# EAGLE design lm3915LEDv.1 (EAGLE 9.3.2)
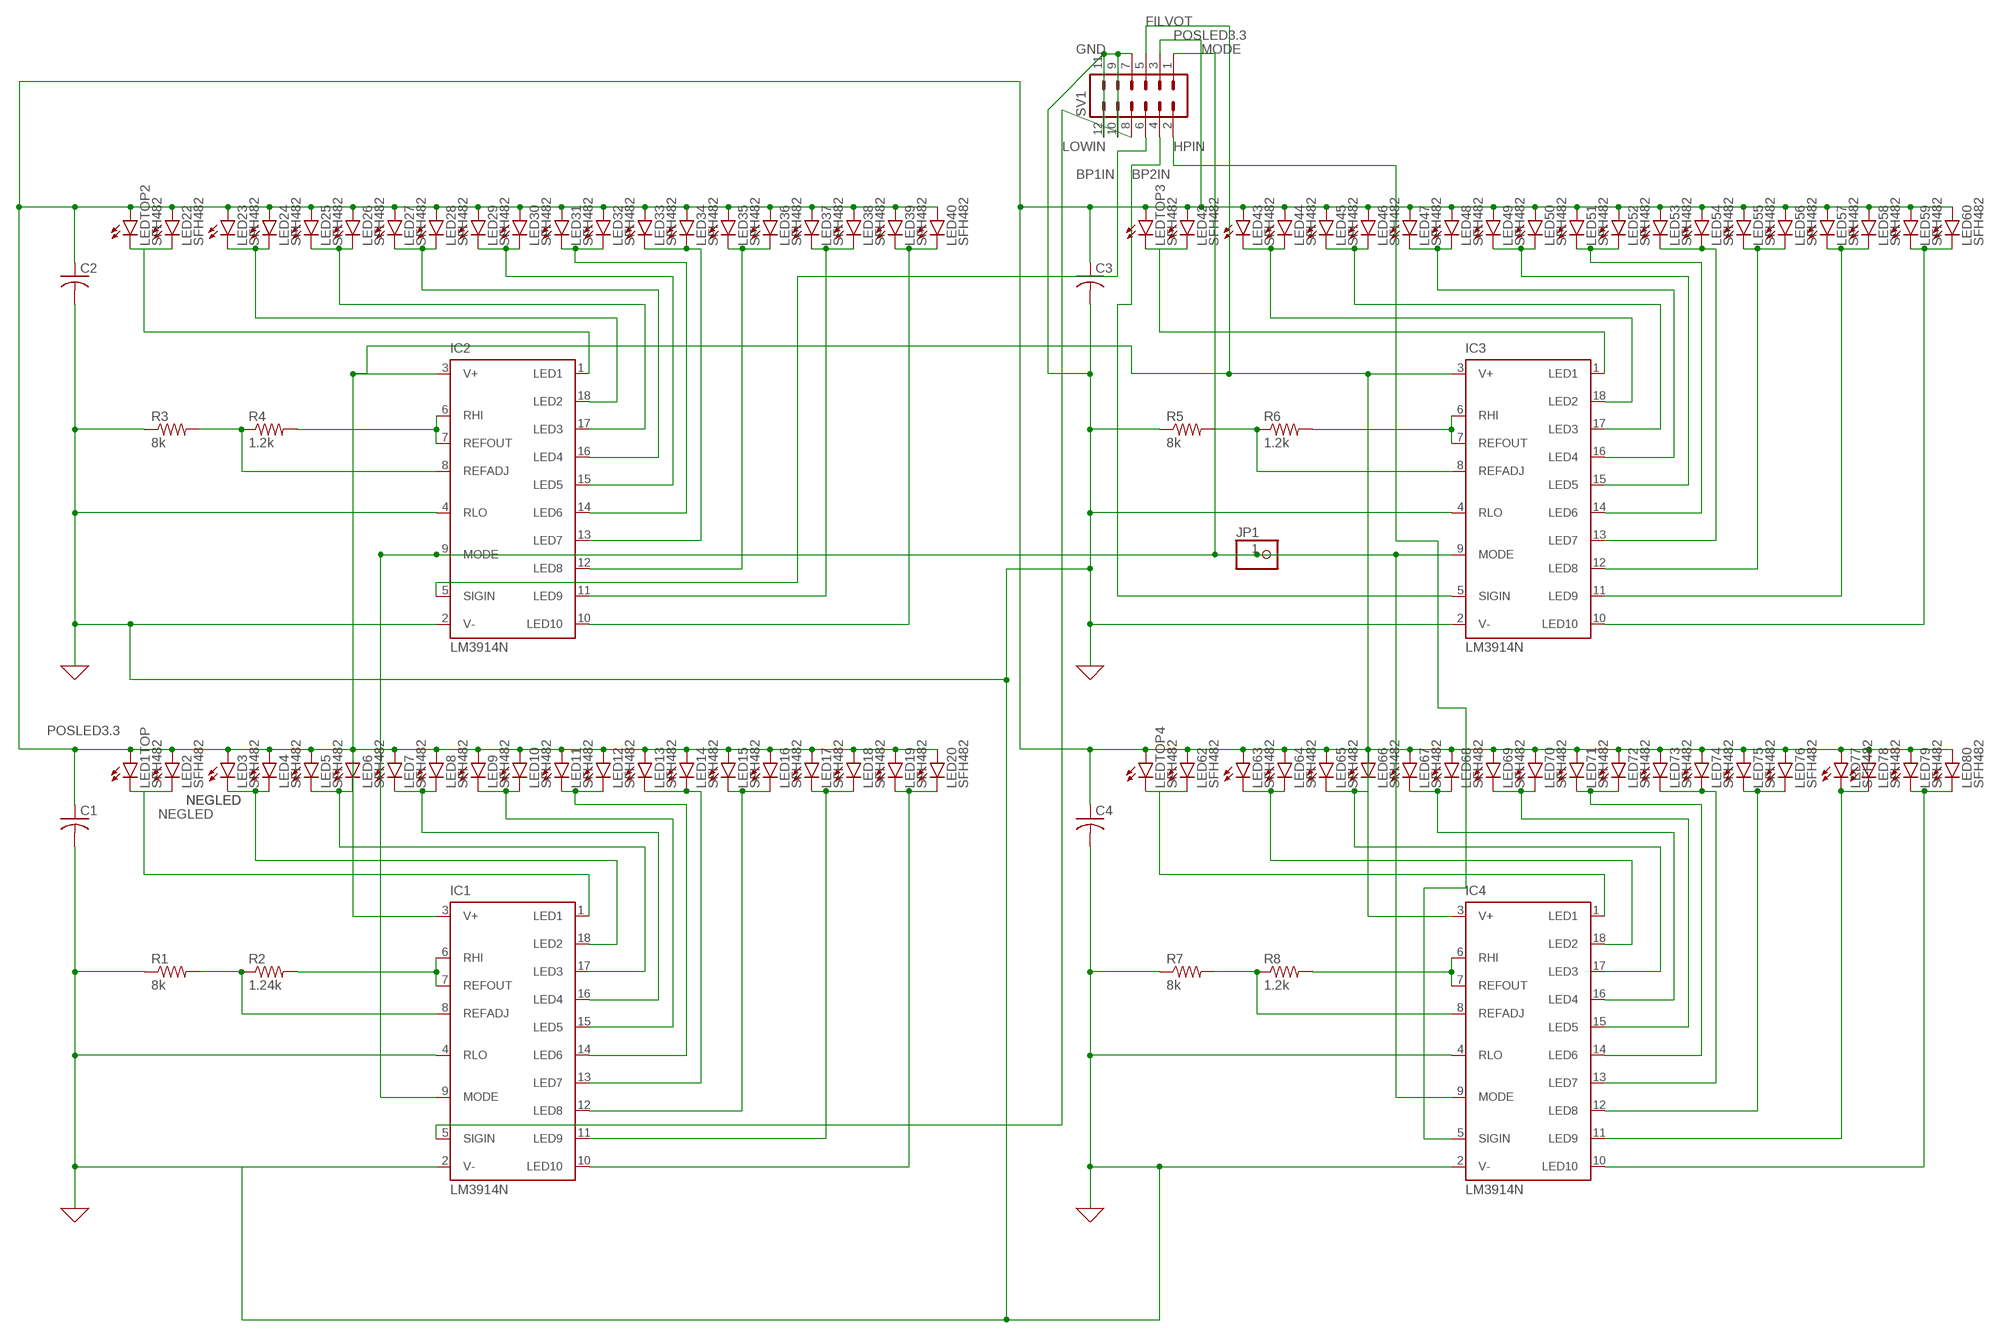
[diagram p0: schematic, sheet 1]

## Parts
C1  C-US025-030X050  [C025-030X050]
C2  C-US025-030X050  [C025-030X050]
C3  C-US025-030X050  [C025-030X050]
C4  C-US025-030X050  [C025-030X050]
IC1  LM3914N  [DIL18]
IC2  LM3914N  [DIL18]
IC3  LM3914N  [DIL18]
IC4  LM3914N  [DIL18]
JP1  PINHD-1X1  [1X01]
LED1TOP  SFH482  [SFH482]
LED2  SFH482  [SFH482]
LED3  SFH482  [SFH482]
LED4  SFH482  [SFH482]
LED5  SFH482  [SFH482]
LED6  SFH482  [SFH482]
LED7  SFH482  [SFH482]
LED8  SFH482  [SFH482]
LED9  SFH482  [SFH482]
LED10  SFH482  [SFH482]
LED11  SFH482  [SFH482]
LED12  SFH482  [SFH482]
LED13  SFH482  [SFH482]
LED14  SFH482  [SFH482]
LED15  SFH482  [SFH482]
LED16  SFH482  [SFH482]
LED17  SFH482  [SFH482]
LED18  SFH482  [SFH482]
LED19  SFH482  [SFH482]
LED20  SFH482  [SFH482]
LED22  SFH482  [SFH482]
LED23  SFH482  [SFH482]
LED24  SFH482  [SFH482]
LED25  SFH482  [SFH482]
LED26  SFH482  [SFH482]
LED27  SFH482  [SFH482]
LED28  SFH482  [SFH482]
LED29  SFH482  [SFH482]
LED30  SFH482  [SFH482]
LED31  SFH482  [SFH482]
LED32  SFH482  [SFH482]
LED33  SFH482  [SFH482]
LED34  SFH482  [SFH482]
LED35  SFH482  [SFH482]
LED36  SFH482  [SFH482]
LED37  SFH482  [SFH482]
LED38  SFH482  [SFH482]
LED39  SFH482  [SFH482]
LED40  SFH482  [SFH482]
LED42  SFH482  [SFH482]
LED43  SFH482  [SFH482]
LED44  SFH482  [SFH482]
LED45  SFH482  [SFH482]
LED46  SFH482  [SFH482]
LED47  SFH482  [SFH482]
LED48  SFH482  [SFH482]
LED49  SFH482  [SFH482]
LED50  SFH482  [SFH482]
LED51  SFH482  [SFH482]
LED52  SFH482  [SFH482]
LED53  SFH482  [SFH482]
LED54  SFH482  [SFH482]
LED55  SFH482  [SFH482]
LED56  SFH482  [SFH482]
LED57  SFH482  [SFH482]
LED58  SFH482  [SFH482]
LED59  SFH482  [SFH482]
LED60  SFH482  [SFH482]
LED62  SFH482  [SFH482]
LED63  SFH482  [SFH482]
LED64  SFH482  [SFH482]
LED65  SFH482  [SFH482]
LED66  SFH482  [SFH482]
LED67  SFH482  [SFH482]
LED68  SFH482  [SFH482]
LED69  SFH482  [SFH482]
LED70  SFH482  [SFH482]
LED71  SFH482  [SFH482]
LED72  SFH482  [SFH482]
LED73  SFH482  [SFH482]
LED74  SFH482  [SFH482]
LED75  SFH482  [SFH482]
LED76  SFH482  [SFH482]
LED77  SFH482  [SFH482]
LED78  SFH482  [SFH482]
LED79  SFH482  [SFH482]
LED80  SFH482  [SFH482]
LEDTOP2  SFH482  [SFH482]
LEDTOP3  SFH482  [SFH482]
LEDTOP4  SFH482  [SFH482]
R1  8k  R-US_0207/10  [0207/10]
R2  1.24k  R-US_0207/10  [0207/10]
R3  8k  R-US_0207/10  [0207/10]
R4  1.2k  R-US_0207/10  [0207/10]
R5  8k  R-US_0207/10  [0207/10]
R6  1.2k  R-US_0207/10  [0207/10]
R7  8k  R-US_0207/10  [0207/10]
R8  1.2k  R-US_0207/10  [0207/10]
SV1  MA06-2  [MA06-2]

## Nets
BP1IN: IC2.5(SIGIN) SV1.6
BP2IN: IC3.5(SIGIN) SV1.4
FILVOT: IC1.3(V+) IC2.3(V+) IC3.3(V+) IC4.3(V+) SV1.5
GND: C1.2 C2.2 C3.2 C4.2 IC1.2(V-) IC1.4(RLO) IC2.2(V-) IC2.4(RLO) IC3.2(V-) IC3.4(RLO) IC4.2(V-) IC4.4(RLO) R1.1 R3.1 R5.1 R7.1 SV1.7 SV1.9 SV1.10 SV1.11 SV1.12
HPIN: IC4.5(SIGIN) SV1.2
LOWIN: IC1.5(SIGIN) SV1.8
MODE: IC1.9(MODE) IC2.9(MODE) IC3.9(MODE) IC4.9(MODE) JP1.1 SV1.1
N$3: IC1.18(LED2) LED3.K(C) LED4.K(C)
N$4: IC1.17(LED3) LED5.K(C) LED6.K(C)
N$5: IC1.16(LED4) LED7.K(C) LED8.K(C)
N$6: IC1.15(LED5) LED9.K(C) LED10.K(C)
N$7: IC1.14(LED6) LED11.K(C) LED12.K(C)
N$8: IC1.13(LED7) LED13.K(C) LED14.K(C)
N$9: IC1.12(LED8) LED15.K(C) LED16.K(C)
N$10: IC1.11(LED9) LED17.K(C) LED18.K(C)
N$11: IC1.10(LED10) LED19.K(C) LED20.K(C)
N$12: IC4.1(LED1) LED62.K(C) LEDTOP4.K(C)
N$13: IC2.1(LED1) LED22.K(C) LEDTOP2.K(C)
N$14: IC2.18(LED2) LED23.K(C) LED24.K(C)
N$15: IC2.17(LED3) LED25.K(C) LED26.K(C)
N$16: IC2.16(LED4) LED27.K(C) LED28.K(C)
N$18: IC2.15(LED5) LED29.K(C) LED30.K(C)
N$21: IC1.6(RHI) IC1.7(REFOUT) R2.2
N$22: IC1.8(REFADJ) R1.2 R2.1
N$23: IC2.14(LED6) LED31.K(C) LED32.K(C)
N$24: IC2.13(LED7) LED33.K(C) LED34.K(C)
N$25: IC2.12(LED8) LED35.K(C) LED36.K(C)
N$26: IC2.11(LED9) LED37.K(C) LED38.K(C)
N$27: IC2.10(LED10) LED39.K(C) LED40.K(C)
N$31: IC2.6(RHI) IC2.7(REFOUT) R4.2
N$32: IC2.8(REFADJ) R3.2 R4.1
N$33: IC3.1(LED1) LED42.K(C) LEDTOP3.K(C)
N$34: IC3.18(LED2) LED43.K(C) LED44.K(C)
N$35: IC3.17(LED3) LED45.K(C) LED46.K(C)
N$36: IC3.16(LED4) LED47.K(C) LED48.K(C)
N$37: IC3.15(LED5) LED49.K(C) LED50.K(C)
N$38: IC3.14(LED6) LED51.K(C) LED52.K(C)
N$39: IC3.13(LED7) LED53.K(C) LED54.K(C)
N$40: IC3.12(LED8) LED55.K(C) LED56.K(C)
N$41: IC3.11(LED9) LED57.K(C) LED58.K(C)
N$42: IC3.10(LED10) LED59.K(C) LED60.K(C)
N$46: IC3.6(RHI) IC3.7(REFOUT) R6.2
N$47: IC3.8(REFADJ) R5.2 R6.1
N$48: IC4.18(LED2) LED63.K(C) LED64.K(C)
N$49: IC4.17(LED3) LED65.K(C) LED66.K(C)
N$50: IC4.16(LED4) LED67.K(C) LED68.K(C)
N$51: IC4.15(LED5) LED69.K(C) LED70.K(C)
N$52: IC4.14(LED6) LED71.K(C) LED72.K(C)
N$53: IC4.13(LED7) LED73.K(C) LED74.K(C)
N$54: IC4.12(LED8) LED75.K(C) LED76.K(C)
N$55: IC4.11(LED9) LED77.K(C) LED78.K(C)
N$56: IC4.10(LED10) LED79.K(C) LED80.K(C)
N$60: IC4.6(RHI) IC4.7(REFOUT) R8.2
N$61: IC4.8(REFADJ) R7.2 R8.1
NEGLED: IC1.1(LED1) LED1TOP.K(C) LED2.K(C)
POSLED3.3: C1.1 C2.1 C3.1 C4.1 LED1TOP.A LED2.A LED3.A LED4.A LED5.A LED6.A LED7.A LED8.A LED9.A LED10.A LED11.A LED12.A LED13.A LED14.A LED15.A LED16.A LED17.A LED18.A LED19.A LED20.A LED22.A LED23.A LED24.A LED25.A LED26.A LED27.A LED28.A LED29.A LED30.A LED31.A LED32.A LED33.A LED34.A LED35.A LED36.A LED37.A LED38.A LED39.A LED40.A LED42.A LED43.A LED44.A LED45.A LED46.A LED47.A LED48.A LED49.A LED50.A LED51.A LED52.A LED53.A LED54.A LED55.A LED56.A LED57.A LED58.A LED59.A LED60.A LED62.A LED63.A LED64.A LED65.A LED66.A LED67.A LED68.A LED69.A LED70.A LED71.A LED72.A LED73.A LED74.A LED75.A LED76.A LED77.A LED78.A LED79.A LED80.A LEDTOP2.A LEDTOP3.A LEDTOP4.A SV1.3

## Library data of the parts
C1-C4 = rcl:C-US: CAPACITOR, American symbol; SPICEPREFIX: C
IC1-IC4 = national-semiconductor:LM391: Dot/Bar Display Driver Source: Data sheet LM3915 <http://www.national.com/ds/LM/LM3915.pdf> Data sheet LM3914 <http://www.national.com/ds/LM/LM3914.pdf>
JP1 = pinhead:PINHD-1X1: PIN HEADER
LED1TOP LED2-LED20 LED22-LED40 LED42-LED60 LED62-LED80 LEDTOP2-LEDTOP4 = led:SFH482: IR LED infrared emitting diode, Infineon
R1-R8 = rcl:R-US_: RESISTOR, American symbol; SPICEPREFIX: R
SV1 = con-lstb:MA06-2: PIN HEADER; OC_FARNELL: unknown; OC_NEWARK: unknown

## Net classes
0 default: clearance 0.205 mm

## Board
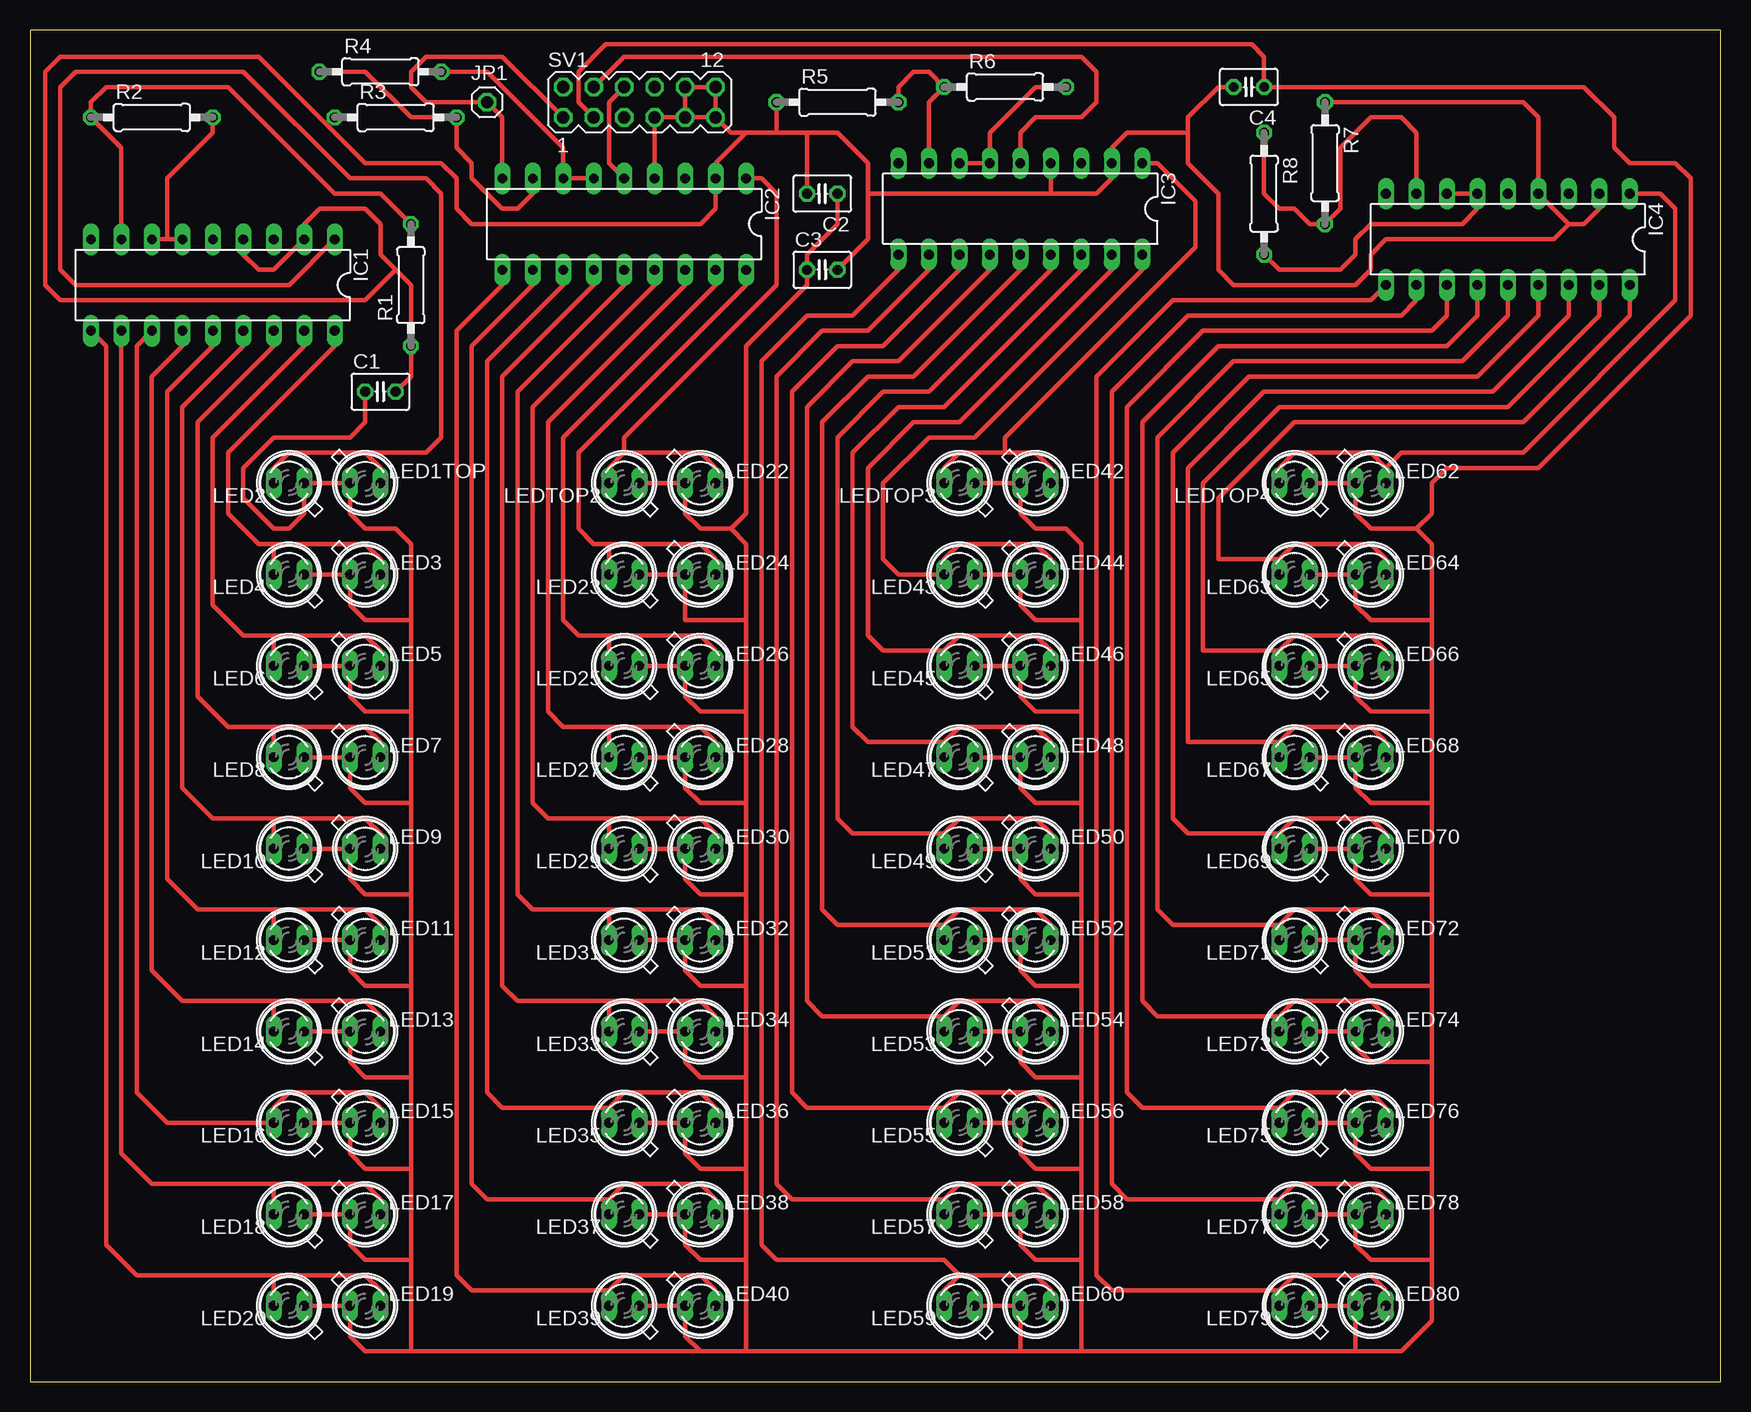
[diagram p1: board, top side]
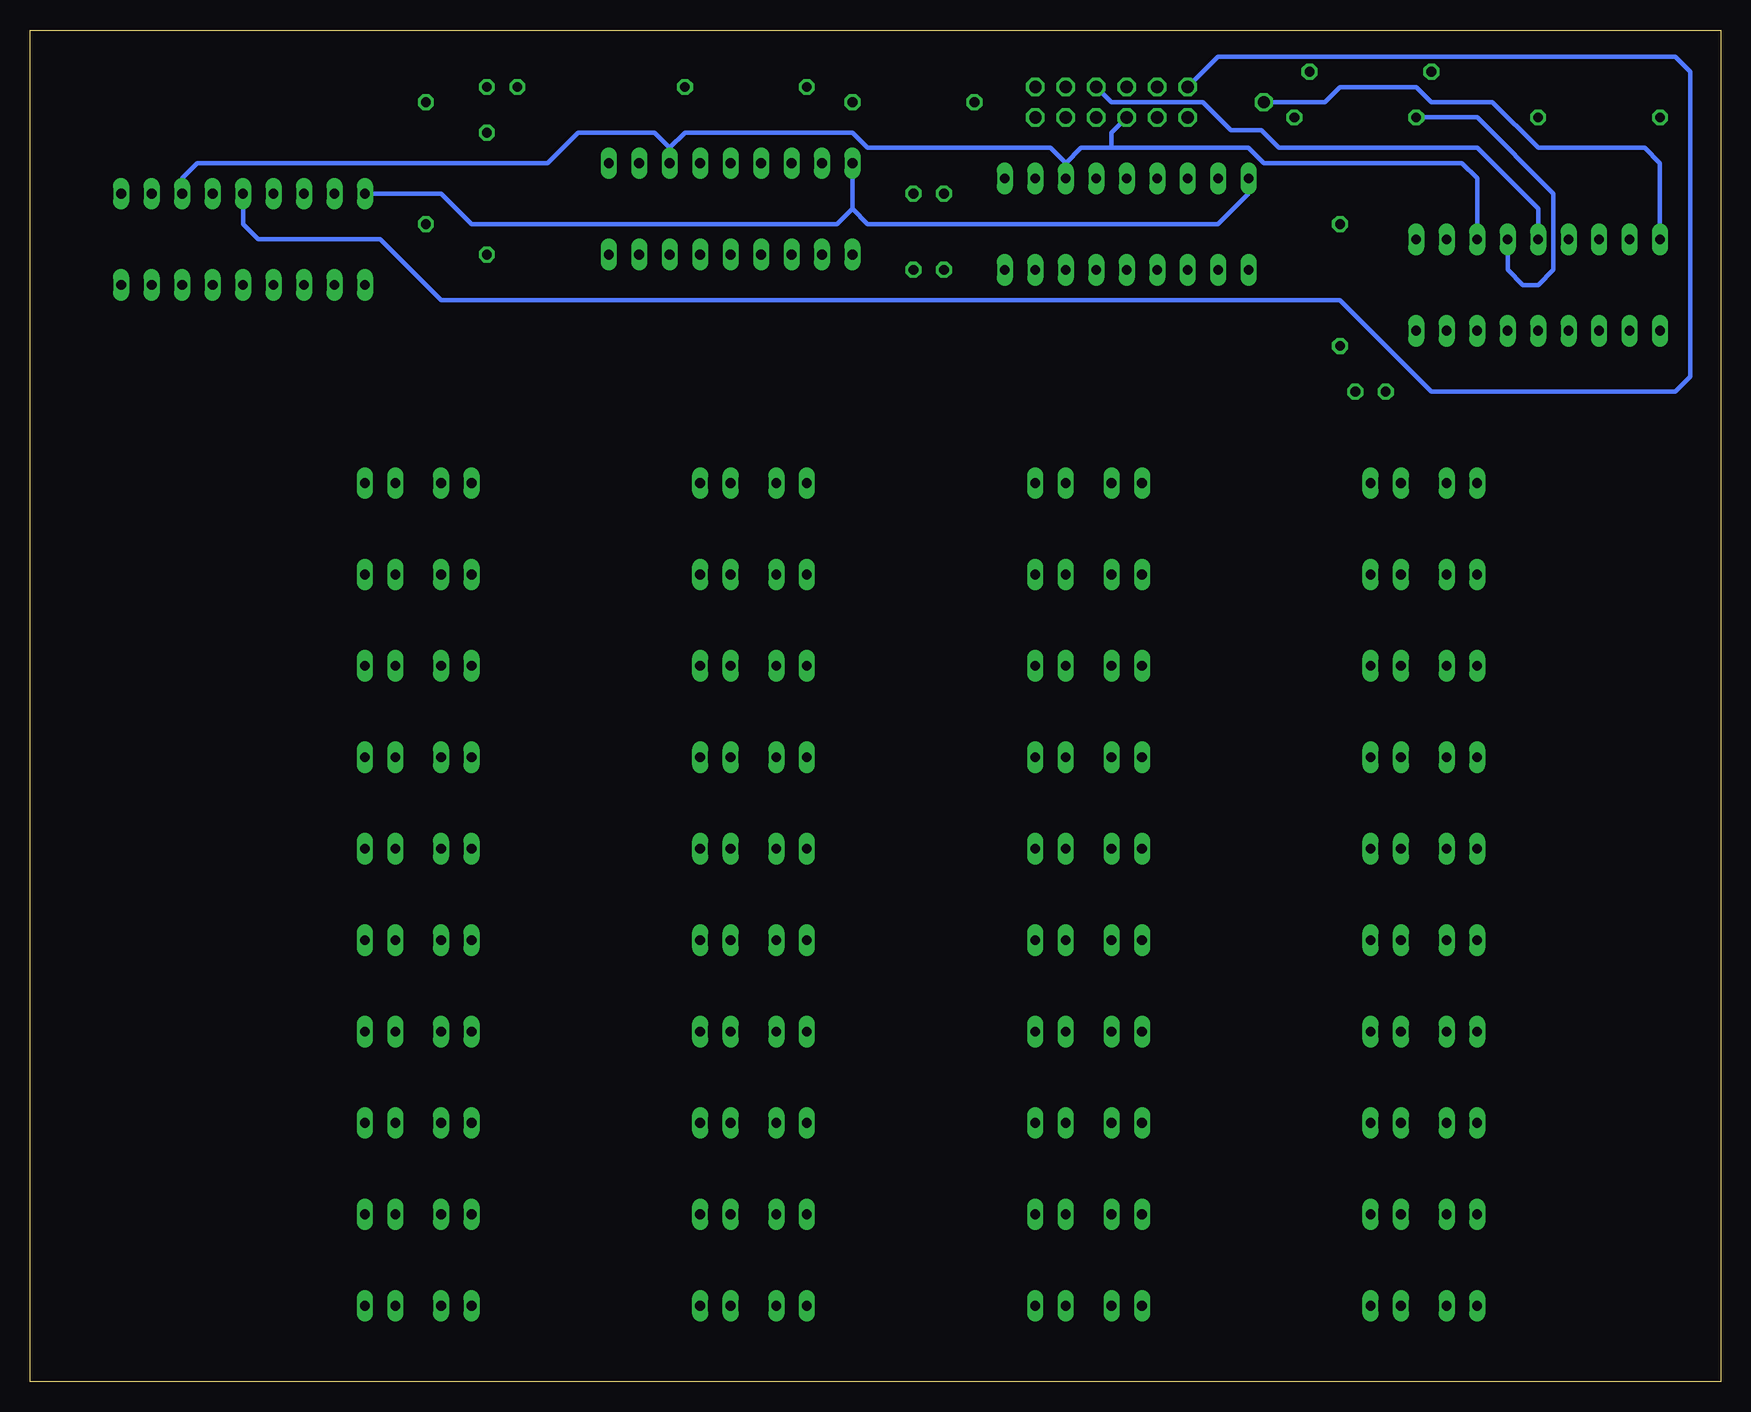
[diagram p2: board, bottom side, seen from below]

Size 140.95 x 112.7 mm. Coordinates in mm from the lower left corner, seen from the top.
Outline: 0,0 140.95,0 140.95,112.7 0,112.7 0,0
Copper layers (1*16): Top 0.035mm / dielectric 1.5mm / Bottom 0.035mm
Design rules "default": minimum track width 6mil, minimum drill 0.35mm, track to track 6mil, track to pad 6mil, pad to pad 6mil, via to via 6mil, smd to smd 6mil, copper to edge 40mil, drill to drill 6mil, minimum pad ring 10mil, minimum via ring 8mil, stop-mask expansion 4mil, vias tented up to drill 0mil, thermal gap 10mil

### Footprints (pad centres in the part's own frame; a part is rotated, then mirrored left to right if it is on the bottom)
C025-030X050 = drill 0.813 octagon: 1 -1.27,0; 2 1.27,0
DIL18 = drill 0.813 long: 1 -10.16,-3.81; 2 -7.62,-3.81; 3 -5.08,-3.81; 4 -2.54,-3.81; 5 0,-3.81; 6 2.54,-3.81; 7 5.08,-3.81; 8 7.62,-3.81; 9 10.16,-3.81; 10 10.16,3.81; 11 7.62,3.81; 12 5.08,3.81; 13 2.54,3.81; 14 0,3.81; 15 -2.54,3.81; 16 -5.08,3.81; 17 -7.62,3.81; 18 -10.16,3.81
1X01 = drill 1.016 octagon: 1 0,0
SFH482 = drill 0.813 long: A -1.27,0; K 1.27,0
0207/10 = drill 0.813 octagon: 1 -5.08,0; 2 5.08,0
MA06-2 = drill 1.016 octagon: 1 -6.35,-1.27; 2 -6.35,1.27; 3 -3.81,-1.27; 4 -3.81,1.27; 5 -1.27,-1.27; 6 -1.27,1.27; 7 1.27,-1.27; 8 1.27,1.27; 9 3.81,-1.27; 10 3.81,1.27; 11 6.35,-1.27; 12 6.35,1.27

### Placement (x,y rotation side)
C1  29.21,82.55 0 top
C2  66.04,99.06 180 top
C3  66.04,92.71 0 top
C4  101.6,107.95 180 top
IC1  15.24,91.44 180 top
IC2  49.53,96.52 180 top
IC3  82.55,97.79 180 top
IC4  123.19,95.25 180 top
JP1  38.1,106.68 0 top
LED1TOP  27.94,74.93 0 top
LED2  21.59,74.93 180 top
LED3  27.94,67.31 0 top
LED4  21.59,67.31 180 top
LED5  27.94,59.69 0 top
LED6  21.59,59.69 180 top
LED7  27.94,52.07 0 top
LED8  21.59,52.07 180 top
LED9  27.94,44.45 0 top
LED10  21.59,44.45 180 top
LED11  27.94,36.83 0 top
LED12  21.59,36.83 180 top
LED13  27.94,29.21 0 top
LED14  21.59,29.21 180 top
LED15  27.94,21.59 0 top
LED16  21.59,21.59 180 top
LED17  27.94,13.97 0 top
LED18  21.59,13.97 180 top
LED19  27.94,6.35 0 top
LED20  21.59,6.35 180 top
LED22  55.88,74.93 0 top
LED23  49.53,67.31 180 top
LED24  55.88,67.31 0 top
LED25  49.53,59.69 180 top
LED26  55.88,59.69 0 top
LED27  49.53,52.07 180 top
LED28  55.88,52.07 0 top
LED29  49.53,44.45 180 top
LED30  55.88,44.45 0 top
LED31  49.53,36.83 180 top
LED32  55.88,36.83 0 top
LED33  49.53,29.21 180 top
LED34  55.88,29.21 0 top
LED35  49.53,21.59 180 top
LED36  55.88,21.59 0 top
LED37  49.53,13.97 180 top
LED38  55.88,13.97 0 top
LED39  49.53,6.35 180 top
LED40  55.88,6.35 0 top
LED42  83.82,74.93 0 top
LED43  77.47,67.31 180 top
LED44  83.82,67.31 0 top
LED45  77.47,59.69 180 top
LED46  83.82,59.69 0 top
LED47  77.47,52.07 180 top
LED48  83.82,52.07 0 top
LED49  77.47,44.45 180 top
LED50  83.82,44.45 0 top
LED51  77.47,36.83 180 top
LED52  83.82,36.83 0 top
LED53  77.47,29.21 180 top
LED54  83.82,29.21 0 top
LED55  77.47,21.59 180 top
LED56  83.82,21.59 0 top
LED57  77.47,13.97 180 top
LED58  83.82,13.97 0 top
LED59  77.47,6.35 180 top
LED60  83.82,6.35 0 top
LED62  111.76,74.93 0 top
LED63  105.41,67.31 180 top
LED64  111.76,67.31 0 top
LED65  105.41,59.69 180 top
LED66  111.76,59.69 0 top
LED67  105.41,52.07 180 top
LED68  111.76,52.07 0 top
LED69  105.41,44.45 180 top
LED70  111.76,44.45 0 top
LED71  105.41,36.83 180 top
LED72  111.76,36.83 0 top
LED73  105.41,29.21 180 top
LED74  111.76,29.21 0 top
LED75  105.41,21.59 180 top
LED76  111.76,21.59 0 top
LED77  105.41,13.97 180 top
LED78  111.76,13.97 0 top
LED79  105.41,6.35 180 top
LED80  111.76,6.35 0 top
LEDTOP2  49.53,74.93 180 top
LEDTOP3  77.47,74.93 180 top
LEDTOP4  105.41,74.93 180 top
R1  31.75,91.44 90 top
R2  10.16,105.41 0 top
R3  30.48,105.41 0 top
R4  29.21,109.22 0 top
R5  67.31,106.68 0 top
R6  81.28,107.95 0 top
R7  107.95,101.6 270 top
R8  102.87,99.06 270 top
SV1  50.8,106.68 0 top

### Tracks (layer width: path | path; a pad name or v marks a point on that pad's centre or on a via)
BP1IN
  Top 0.381: SV1.6 48.26,106.68 48.26,101.6 IC2.5
BP2IN
  Top 0.381: SV1.4 49.53,110.49 87.63,110.49 88.9,109.22 88.9,106.68 87.63,105.41 83.82,105.41 82.55,104.14 IC3.5
FILVOT
  Bottom 0.381: IC4.3 128.27,100.33 127,101.6 97.79,101.6 95.25,104.14 88.9,104.14 87.63,102.87 | IC3.3 87.63,102.87 | 50.8,102.87 39.37,102.87 38.1,101.6 21.59,101.6 20.32,100.33 IC1.3 | 50.8,102.87 53.34,102.87 54.61,101.6 | 54.61,101.6 55.88,102.87 71.12,102.87 72.39,104.14 86.36,104.14 87.63,102.87 | SV1.5 50.8,104.14 50.8,102.87 | IC2.3 54.61,101.6
GND
  Top 0.381: IC3.4 85.09,99.06 | 85.09,99.06 69.85,99.06 | 59.69,104.14 57.15,101.6 IC2.2 57.15,97.79 55.88,96.52 36.83,96.52 35.56,97.79 35.56,100.33 34.29,101.6 27.94,101.6 19.05,110.49 2.54,110.49 1.27,109.22 1.27,91.44 2.54,90.17 27.94,90.17 30.48,92.71 | 59.69,104.14 62.23,104.14 | 62.23,104.14 64.77,104.14 | 64.77,104.14 C2.2 | 69.85,99.06 69.85,95.25 C3.2 | 69.85,99.06 69.85,101.6 67.31,104.14 64.77,104.14 | 85.09,99.06 88.9,99.06 90.17,100.33 IC3.2 90.17,102.87 91.44,104.14 96.52,104.14 | 62.23,104.14 R5.1 | 128.27,96.52 IC4.4 125.73,105.41 124.46,106.68 R7.1 | 128.27,96.52 129.54,96.52 130.81,97.79 IC4.2 | 96.52,104.14 96.52,105.41 99.06,107.95 C4.2 | 96.52,104.14 96.52,101.6 99.06,99.06 99.06,92.71 100.33,91.44 110.49,91.44 111.76,92.71 111.76,93.98 113.03,95.25 127,95.25 128.27,96.52 | IC1.4 17.78,93.98 19.05,92.71 20.32,92.71 IC1.2 22.86,96.52 24.13,97.79 27.94,97.79 29.21,96.52 29.21,93.98 30.48,92.71 | C1.2 31.75,83.82 R1.1 31.75,91.44 30.48,92.71 | SV1.9 SV1.7 IC2.4 | SV1.9 SV1.10 SV1.12 SV1.11 | SV1.11 SV1.9 | SV1.11 58.42,104.14 59.69,104.14
  Bottom 0.381: R3.1 20.32,105.41 13.97,99.06 13.97,92.71 15.24,91.44 16.51,91.44 17.78,92.71 IC1.4
HPIN
  Bottom 0.381: SV1.2 41.91,110.49 3.81,110.49 2.54,109.22 2.54,83.82 3.81,82.55 24.13,82.55 31.75,90.17 106.68,90.17 111.76,95.25 121.92,95.25 123.19,96.52 IC4.5
LOWIN
  Bottom 0.381: IC1.5 15.24,97.79 20.32,102.87 36.83,102.87 38.31,104.35 40.85,104.35 43.18,106.68 50.8,106.68 SV1.8
MODE
  Top 0.381: SV1.1 39.37,110.49 33.02,110.49 31.75,109.22 31.75,107.95 33.02,106.68 JP1.1 39.37,105.41 IC2.9
  Bottom 0.381: 72.39,97.79 71.12,96.52 41.91,96.52 39.37,99.06 IC2.9 | 72.39,97.79 IC3.9 | 72.39,97.79 73.66,96.52 104.14,96.52 106.68,99.06 IC4.9 | IC1.9 5.08,101.6 6.35,102.87 15.24,102.87 19.05,106.68 24.13,106.68 25.4,107.95 31.75,107.95 33.02,106.68 JP1.1
N$3
  Top 0.381: 20.32,69.85 LED4.K | 20.32,69.85 19.05,69.85 16.51,72.39 16.51,77.47 25.4,86.36 IC1.18 | 20.32,69.85 27.94,69.85 29.21,68.58 LED3.K
N$4
  Top 0.381: LED5.K 29.21,60.96 27.94,62.23 20.32,62.23 | 20.32,62.23 LED6.K | 20.32,62.23 17.78,62.23 15.24,64.77 15.24,78.74 22.86,86.36 IC1.17
N$5
  Top 0.381: LED7.K 29.21,53.34 27.94,54.61 20.32,54.61 | 20.32,54.61 LED8.K | 20.32,54.61 16.51,54.61 13.97,57.15 13.97,80.01 20.32,86.36 IC1.16
N$6
  Top 0.381: LED9.K 29.21,45.72 27.94,46.99 20.32,46.99 | 20.32,46.99 LED10.K | IC1.15 17.78,86.36 12.7,81.28 12.7,49.53 15.24,46.99 20.32,46.99
N$7
  Top 0.381: LED11.K 29.21,38.1 27.94,39.37 20.32,39.37 | 20.32,39.37 LED12.K | 20.32,39.37 13.97,39.37 11.43,41.91 11.43,82.55 15.24,86.36 IC1.14
N$8
  Top 0.381: LED13.K 29.21,30.48 27.94,31.75 20.32,31.75 | 20.32,31.75 LED14.K | IC1.13 12.7,86.36 10.16,83.82 10.16,34.29 12.7,31.75 20.32,31.75
N$9
  Top 0.381: LED15.K 29.21,22.86 27.94,24.13 21.59,24.13 20.32,22.86 LED16.K 11.43,21.59 8.89,24.13 8.89,86.36 IC1.12
N$10
  Top 0.381: LED17.K 29.21,15.24 27.94,16.51 20.32,16.51 | 20.32,16.51 LED18.K | 20.32,16.51 10.16,16.51 7.62,19.05 IC1.11
N$11
  Top 0.381: LED19.K 29.21,7.62 27.94,8.89 20.32,8.89 | 20.32,8.89 LED20.K | 20.32,8.89 8.89,8.89 6.35,11.43 6.35,86.36 IC1.10
N$12
  Top 0.381: LEDTOP4.K 104.14,76.2 105.41,77.47 111.76,77.47 113.03,76.2 | 113.03,76.2 LED62.K | 113.03,76.2 114.3,77.47 124.46,77.47 137.16,90.17 137.16,97.79 135.89,99.06 IC4.1
N$13
  Top 0.381: LEDTOP2.K 48.26,76.2 49.53,77.47 | 49.53,77.47 55.88,77.47 57.15,76.2 LED22.K | 49.53,77.47 49.53,78.74 62.23,91.44 62.23,99.06 60.96,100.33 IC2.1
N$14
  Top 0.381: LED23.K 48.26,69.85 | LED24.K 57.15,68.58 55.88,69.85 48.26,69.85 | 48.26,69.85 46.99,69.85 45.72,71.12 45.72,77.47 59.69,91.44 IC2.18
N$15
  Top 0.381: LED26.K 57.15,60.96 55.88,62.23 48.26,62.23 | 48.26,62.23 LED25.K | 48.26,62.23 45.72,62.23 44.45,63.5 44.45,78.74 57.15,91.44 IC2.17
N$16
  Top 0.381: 48.26,54.61 LED27.K | LED28.K 57.15,53.34 55.88,54.61 48.26,54.61 | 48.26,54.61 44.45,54.61 43.18,55.88 43.18,80.01 54.61,91.44 IC2.16
N$18
  Top 0.381: LED30.K 57.15,45.72 55.88,46.99 48.26,46.99 | 48.26,46.99 LED29.K | 48.26,46.99 43.18,46.99 41.91,48.26 41.91,81.28 52.07,91.44 IC2.15
N$21
  Top 0.381: IC1.6 IC1.7 11.43,95.25 11.43,100.33 15.24,104.14 R2.2
N$22
  Top 0.381: R1.2 29.21,99.06 25.4,99.06 16.51,107.95 6.35,107.95 5.08,106.68 R2.1 7.62,102.87 IC1.8
N$23
  Top 0.381: 48.26,39.37 LED31.K | LED32.K 57.15,38.1 55.88,39.37 48.26,39.37 | 48.26,39.37 41.91,39.37 40.64,40.64 40.64,82.55 49.53,91.44 IC2.14
N$24
  Top 0.381: 48.26,31.75 LED33.K | 48.26,31.75 55.88,31.75 57.15,30.48 LED34.K | 48.26,31.75 40.64,31.75 39.37,33.02 39.37,83.82 46.99,91.44 IC2.13
N$25
  Top 0.381: 48.26,22.86 LED35.K | LED36.K 57.15,22.86 55.88,24.13 49.53,24.13 48.26,22.86 | 48.26,22.86 39.37,22.86 38.1,24.13 38.1,85.09 44.45,91.44 IC2.12
N$26
  Top 0.381: LED37.K 48.26,15.24 | 48.26,15.24 49.53,16.51 55.88,16.51 57.15,15.24 LED38.K | 48.26,15.24 38.1,15.24 36.83,16.51 36.83,86.36 41.91,91.44 IC2.11
N$27
  Top 0.381: LED40.K 57.15,7.62 55.88,8.89 49.53,8.89 48.26,7.62 | LED39.K 48.26,7.62 | 48.26,7.62 36.83,7.62 35.56,8.89 35.56,87.63 39.37,91.44 IC2.10
N$31
  Top 0.381: R4.2 38.1,109.22 44.45,102.87 IC2.7 IC2.6
N$32
  Top 0.381: R4.1 27.94,109.22 31.75,105.41 R3.2 35.56,102.87 36.83,101.6 36.83,100.33 39.37,97.79 40.64,97.79 41.91,99.06 IC2.8
N$33
  Top 0.381: LEDTOP3.K 76.2,76.2 77.47,77.47 81.28,77.47 | 81.28,77.47 83.82,77.47 85.09,76.2 LED42.K | IC3.1 93.98,101.6 97.16,98.42 97.16,94.61 81.28,78.74 81.28,77.47
N$34
  Top 0.381: LED44.K 85.09,68.58 83.82,69.85 77.47,69.85 76.2,68.58 LED43.K 72.39,67.31 71.12,68.58 71.12,74.93 74.93,78.74 78.74,78.74 92.71,92.71 IC3.18
N$35
  Top 0.381: LED45.K 76.2,60.96 | 76.2,60.96 77.47,62.23 83.82,62.23 85.09,60.96 LED46.K | IC3.17 90.17,92.71 77.47,80.01 73.66,80.01 69.85,76.2 69.85,62.23 71.12,60.96 76.2,60.96
N$36
  Top 0.381: LED47.K 76.2,53.34 | 76.2,53.34 77.47,54.61 83.82,54.61 85.09,53.34 LED48.K | IC3.16 87.63,92.71 76.2,81.28 72.39,81.28 68.58,77.47 68.58,54.61 69.85,53.34 76.2,53.34
N$37
  Top 0.381: LED49.K 76.2,45.72 | 76.2,45.72 77.47,46.99 83.82,46.99 85.09,45.72 LED50.K | 76.2,45.72 68.58,45.72 67.31,46.99 67.31,78.74 71.12,82.55 74.93,82.55 85.09,92.71 IC3.15
N$38
  Top 0.381: LED51.K 76.2,38.1 | 76.2,38.1 77.47,39.37 83.82,39.37 85.09,38.1 LED52.K | IC3.14 82.55,92.71 73.66,83.82 69.85,83.82 66.04,80.01 66.04,39.37 67.31,38.1 76.2,38.1
N$39
  Top 0.381: LED53.K 76.2,30.48 | 76.2,30.48 77.47,31.75 83.82,31.75 85.09,30.48 LED54.K | 76.2,30.48 66.04,30.48 64.77,31.75 64.77,81.28 68.58,85.09 72.39,85.09 80.01,92.71 IC3.13
N$40
  Top 0.381: LED55.K 76.2,22.86 | 76.2,22.86 77.47,24.13 83.82,24.13 85.09,22.86 LED56.K | IC3.12 77.47,92.71 71.12,86.36 67.31,86.36 63.5,82.55 63.5,24.13 64.77,22.86 76.2,22.86
N$41
  Top 0.381: LED57.K 76.2,15.24 | 76.2,15.24 77.47,16.51 83.82,16.51 85.09,15.24 LED58.K | 76.2,15.24 63.5,15.24 62.23,16.51 62.23,83.82 66.04,87.63 69.85,87.63 74.93,92.71 IC3.11
N$42
  Top 0.381: LED59.K 76.2,7.62 77.47,8.89 | 77.47,8.89 83.82,8.89 85.09,7.62 LED60.K | IC3.10 72.39,92.71 68.58,88.9 64.77,88.9 60.96,85.09 60.96,11.43 62.23,10.16 76.2,10.16 77.47,8.89
N$46
  Top 0.381: IC3.7 IC3.6 80.01,104.14 83.82,107.95 R6.2
N$47
  Top 0.381: IC3.8 74.93,106.68 R6.1 74.93,109.22 73.66,109.22 72.39,107.95 R5.2
N$48
  Top 0.381: LED63.K 104.14,68.58 | 104.14,68.58 105.41,69.85 111.76,69.85 113.03,68.58 LED64.K | 104.14,68.58 99.06,68.58 99.06,73.66 105.41,80.01 124.46,80.01 133.35,88.9 IC4.18
N$49
  Top 0.381: LED65.K 104.14,60.96 | 104.14,60.96 105.41,62.23 111.76,62.23 113.03,60.96 LED66.K | IC4.17 130.81,88.9 123.19,81.28 104.14,81.28 97.79,74.93 97.79,60.96 104.14,60.96
N$50
  Top 0.381: LED67.K 104.14,53.34 | 104.14,53.34 105.41,54.61 111.76,54.61 113.03,53.34 LED68.K | 104.14,53.34 96.52,53.34 96.52,76.2 102.87,82.55 121.92,82.55 128.27,88.9 IC4.16
N$51
  Top 0.381: LED69.K 104.14,45.72 | 104.14,45.72 105.41,46.99 111.76,46.99 113.03,45.72 LED70.K | 104.14,45.72 96.52,45.72 95.25,46.99 95.25,77.47 101.6,83.82 120.65,83.82 125.73,88.9 IC4.15
N$52
  Top 0.381: LED71.K 104.14,38.1 | 104.14,38.1 105.41,39.37 111.76,39.37 113.03,38.1 LED72.K | IC4.14 123.19,88.9 119.38,85.09 100.33,85.09 93.98,78.74 93.98,39.37 95.25,38.1 104.14,38.1
N$53
  Top 0.381: LED73.K 104.14,30.48 | 104.14,30.48 105.41,31.75 111.76,31.75 113.03,30.48 LED74.K | 104.14,30.48 93.98,30.48 92.71,31.75 92.71,80.01 99.06,86.36 118.11,86.36 120.65,88.9 IC4.13
N$54
  Top 0.381: LED75.K 104.14,22.86 | 104.14,22.86 105.41,24.13 111.76,24.13 113.03,22.86 LED76.K | IC4.12 118.11,88.9 116.84,87.63 97.79,87.63 91.44,81.28 91.44,24.13 92.71,22.86 104.14,22.86
N$55
  Top 0.381: LED77.K 104.14,15.24 | 104.14,15.24 105.41,16.51 111.76,16.51 113.03,15.24 LED78.K | 104.14,15.24 91.44,15.24 90.17,16.51 90.17,82.55 96.52,88.9 114.3,88.9 115.57,90.17 IC4.11
N$56
  Top 0.381: LED79.K 104.14,7.62 | 104.14,7.62 105.41,8.89 111.76,8.89 113.03,7.62 LED80.K | 104.14,7.62 90.17,7.62 88.9,8.89 88.9,83.82 95.25,90.17 111.76,90.17 IC4.10
N$60
  Top 0.381: IC4.7 IC4.6 120.65,97.79 119.38,96.52 111.76,96.52 110.49,95.25 110.49,93.98 109.22,92.71 104.14,92.71 R8.2
N$61
  Top 0.381: R8.1 102.87,99.06 104.14,97.79 105.41,97.79 106.68,96.52 R7.2 109.22,97.79 109.22,102.87 111.76,105.41 114.3,105.41 115.57,104.14 IC4.8
NEGLED
  Top 0.381: LED1TOP.K 29.21,76.2 27.94,77.47 | LED2.K 20.32,76.2 21.59,77.47 27.94,77.47 | IC1.1 21.59,91.44 3.81,91.44 2.54,92.71 2.54,107.95 3.81,109.22 17.78,109.22 26.67,100.33 33.02,100.33 34.29,99.06 34.29,78.74 33.02,77.47 27.94,77.47
POSLED3.3
  Top 0.381: LED20.A LED19.A 26.67,3.81 27.94,2.54 31.75,2.54 | LED18.A LED17.A 26.67,11.43 27.94,10.16 31.75,10.16 | LED16.A LED15.A 26.67,19.05 27.94,17.78 31.75,17.78 | LED14.A LED13.A 26.67,26.67 27.94,25.4 31.75,25.4 | LED12.A LED11.A 26.67,34.29 27.94,33.02 31.75,33.02 | LED10.A LED9.A 26.67,41.91 27.94,40.64 31.75,40.64 | LED8.A LED7.A 26.67,49.53 27.94,48.26 31.75,48.26 | LED6.A LED5.A 26.67,57.15 27.94,55.88 31.75,55.88 | 31.75,63.5 31.75,69.85 30.48,71.12 27.94,71.12 26.67,72.39 LED1TOP.A LED2.A 22.86,72.39 21.59,71.12 20.32,71.12 17.78,73.66 17.78,76.2 20.32,78.74 26.67,78.74 27.94,80.01 C1.1 | 31.75,63.5 31.75,55.88 | 31.75,55.88 31.75,48.26 | 31.75,48.26 31.75,40.64 | 31.75,40.64 31.75,33.02 | 31.75,33.02 31.75,25.4 | 31.75,25.4 31.75,17.78 | 31.75,17.78 31.75,10.16 | 31.75,10.16 31.75,2.54 | LED39.A LED40.A 54.61,3.81 55.88,2.54 | LED37.A LED38.A 54.61,11.43 55.88,10.16 59.69,10.16 | LED35.A LED36.A 54.61,19.05 55.88,17.78 59.69,17.78 | LED33.A LED34.A 54.61,26.67 55.88,25.4 59.69,25.4 | LED31.A LED32.A 54.61,34.29 55.88,33.02 59.69,33.02 | LED29.A LED30.A 54.61,41.91 55.88,40.64 59.69,40.64 | LED27.A LED28.A 54.61,49.53 55.88,48.26 59.69,48.26 | LED25.A LED26.A 54.61,57.15 55.88,55.88 59.69,55.88 | LED23.A LED24.A 54.61,63.5 59.69,63.5 | LEDTOP2.A LED22.A 54.61,72.39 55.88,71.12 58.42,71.12 | 59.69,10.16 59.69,17.78 | 59.69,17.78 59.69,25.4 | 59.69,25.4 59.69,33.02 | 59.69,33.02 59.69,40.64 | 59.69,40.64 59.69,48.26 | 59.69,48.26 59.69,55.88 | 59.69,55.88 59.69,63.5 | 59.69,63.5 59.69,69.85 58.42,71.12 | LEDTOP3.A LED42.A 82.55,72.39 83.82,71.12 86.36,71.12 87.63,69.85 87.63,63.5
  Top 0.381: LED43.A LED44.A 82.55,64.77 83.82,63.5 87.63,63.5 | LED45.A LED46.A 82.55,57.15 83.82,55.88 87.63,55.88 | LED47.A LED48.A 82.55,49.53 83.82,48.26 87.63,48.26 | LED49.A LED50.A 82.55,41.91 83.82,40.64 87.63,40.64 | LED51.A LED52.A 82.55,34.29 83.82,33.02 87.63,33.02 | LED53.A LED54.A 82.55,26.67 83.82,25.4 87.63,25.4 | LED55.A LED56.A 82.55,19.05 83.82,17.78 87.63,17.78 | LED57.A LED58.A 82.55,11.43 83.82,10.16 87.63,10.16 | LED59.A LED60.A 82.55,2.54 | 59.69,10.16 59.69,2.54 | 59.69,2.54 55.88,2.54 | 87.63,17.78 87.63,25.4 | 87.63,25.4 87.63,33.02 | 87.63,33.02 87.63,40.64 | 87.63,40.64 87.63,48.26 | 87.63,48.26 87.63,55.88 | 58.42,71.12 59.69,72.39 59.69,86.36 64.77,91.44 C3.1 64.77,93.98 67.31,96.52 C2.1 | 31.75,2.54 55.88,2.54 | 59.69,2.54 62.23,2.54 72.39,2.54 82.55,2.54 | 87.63,63.5 87.63,55.88 | 31.75,63.5 27.94,63.5 26.67,64.77 LED3.A LED4.A | LED79.A LED80.A 110.49,2.54 | LED77.A LED78.A 110.49,11.43 111.76,10.16 116.84,10.16 | LED75.A LED76.A 110.49,19.05 111.76,17.78 116.84,17.78 | LED73.A LED74.A 110.49,27.94 111.76,26.67 116.84,26.67 | LED71.A LED72.A 110.49,34.29 111.76,33.02 116.84,33.02 | LED69.A LED70.A 110.49,41.91 111.76,40.64 116.84,40.64 | LED67.A LED68.A 110.49,49.53 111.76,48.26 116.84,48.26 | LED65.A LED66.A 110.49,57.15 111.76,55.88 116.84,55.88 | LED63.A LED64.A 110.49,64.77 111.76,63.5 116.84,63.5 | LEDTOP4.A LED62.A 110.49,72.39 111.76,71.12 115.57,71.12 | 116.84,48.26 116.84,40.64 | 116.84,40.64 116.84,33.02 | 116.84,33.02 116.84,26.67 | 116.84,26.67 116.84,17.78 | 116.84,17.78 116.84,10.16 | 116.84,10.16 116.84,5.08 114.3,2.54 110.49,2.54 | 110.49,2.54 87.63,2.54
  Top 0.381: 87.63,2.54 82.55,2.54 | 87.63,10.16 87.63,17.78 | 87.63,10.16 87.63,2.54 | 116.84,48.26 116.84,55.88 | 116.84,55.88 116.84,63.5 | 116.84,63.5 116.84,69.85 115.57,71.12 | 115.57,71.12 116.84,72.39 116.84,74.93 118.11,76.2 125.73,76.2 138.43,88.9 138.43,100.33 137.16,101.6 133.35,101.6 132.08,102.87 132.08,105.41 129.54,107.95 C4.1 102.87,110.49 101.87,111.49 47.99,111.49 45.72,109.22 45.72,106.68 SV1.3